# EAGLE schematic HeaterThermostatV1 (EAGLE 9.5.2)
COMPANY: ADAFRUIT INDUSTRIES; DRAWN: KTOWN; REV: B
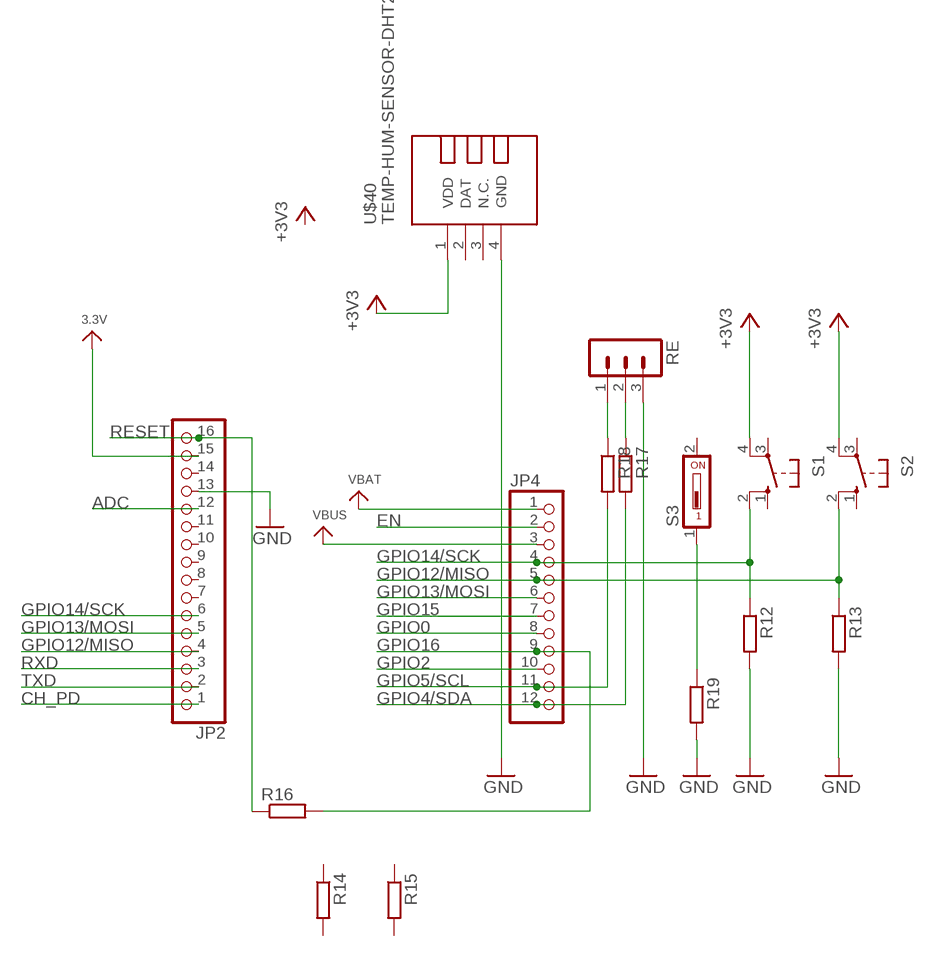
[diagram p0: schematic, sheet 1]

## Parts
JP2  HEADER-1X16ROUND  [1X16_ROUND]
JP4  HEADER-1X12  [1X12_ROUND]
R12  R-EU_0207/10  [0207/10]
R13  R-EU_0207/10  [0207/10]
R14  R-EU_0207/10  [0207/10]
R15  R-EU_0207/10  [0207/10]
R16  R-EU_0207/10  [0207/10]
R17  R-EU_0207/10  [0207/10]
R18  R-EU_0207/10  [0207/10]
R19  R-EU_0207/10  [0207/10]
RE  MA03-1  [MA03-1]
S1  10-XX  [B3F-10XX]
S2  10-XX  [B3F-10XX]
S3  DS01  [DS-01]
U$40  TEMP-HUM-SENSOR-DHT22  [TEMP-HUM-SENSOR-DHT22]

## Nets
3.3V: JP2.15
+3V3: S1.4(P1) S2.4(P1) U$40.1(VDD)
ADC: JP2.12
CH_PD: JP2.1
EN: JP4.2
GND: JP2.13 R12.2 R13.2 R19.2 RE.3 U$40.4(GND)
GPIO0: JP4.8
GPIO2: JP4.10
GPIO4/SDA: JP4.12 R17.2
GPIO5/SCL: JP4.11 R18.2
GPIO12/MISO: JP2.4 JP4.5 R13.1 S2.2(S1)
GPIO13/MOSI: JP2.5 JP4.6
GPIO14/SCK: JP2.6 JP4.4 R12.1 S1.2(S1)
GPIO15: JP4.7
GPIO16: JP4.9 R16.2
N$8: R17.1 RE.2
N$9: R18.1 RE.1
N$10: R19.1 S3.1
RESET: JP2.16 R16.1
RXD: JP2.3
TXD: JP2.2
VBAT: JP4.1
VBUS: JP4.3
Unconnected: JP2.7 JP2.8 JP2.9 JP2.10 JP2.11 JP2.14 R14.1 R14.2 R15.1 R15.2 S1.1(S) S1.3(P) S2.1(S) S2.3(P) S3.2 U$40.2(DAT) U$40.3(N.C.)

## Library data of the parts
JP2 = microbuilder:HEADER-1X16: PIN HEADER
JP4 = microbuilder:HEADER-1X12
R12-R19 = rcl:R-EU_: RESISTOR, European symbol; SPICEPREFIX: R
RE = con-lstb:MA03-1: PIN HEADER; OC_FARNELL: unknown; OC_NEWARK: unknown
S1 S2 = switch-omron:10-XX: OMRON SWITCH; MPN: B3F-1000; OC_FARNELL: 176432; OC_NEWARK: 36M3542
S3 = switch-dil:DS01: DIL/CODE SWITCH; OC_FARNELL: unknown; OC_NEWARK: unknown
U$40 = diy-modules:TEMP-HUM-SENSOR-DHT22: DHT22 - digital humidity & temperature sensor Also known as: AM2302 AM2302 datasheet available here: http://akizukidenshi.com/download/ds/aosong/AM2302.pdf Click here to find device on ebay.com <http://www.ebay.com/sch/dht22+digital+sensor>